# EAGLE schematic ArdBir final (EAGLE 7.1.0)
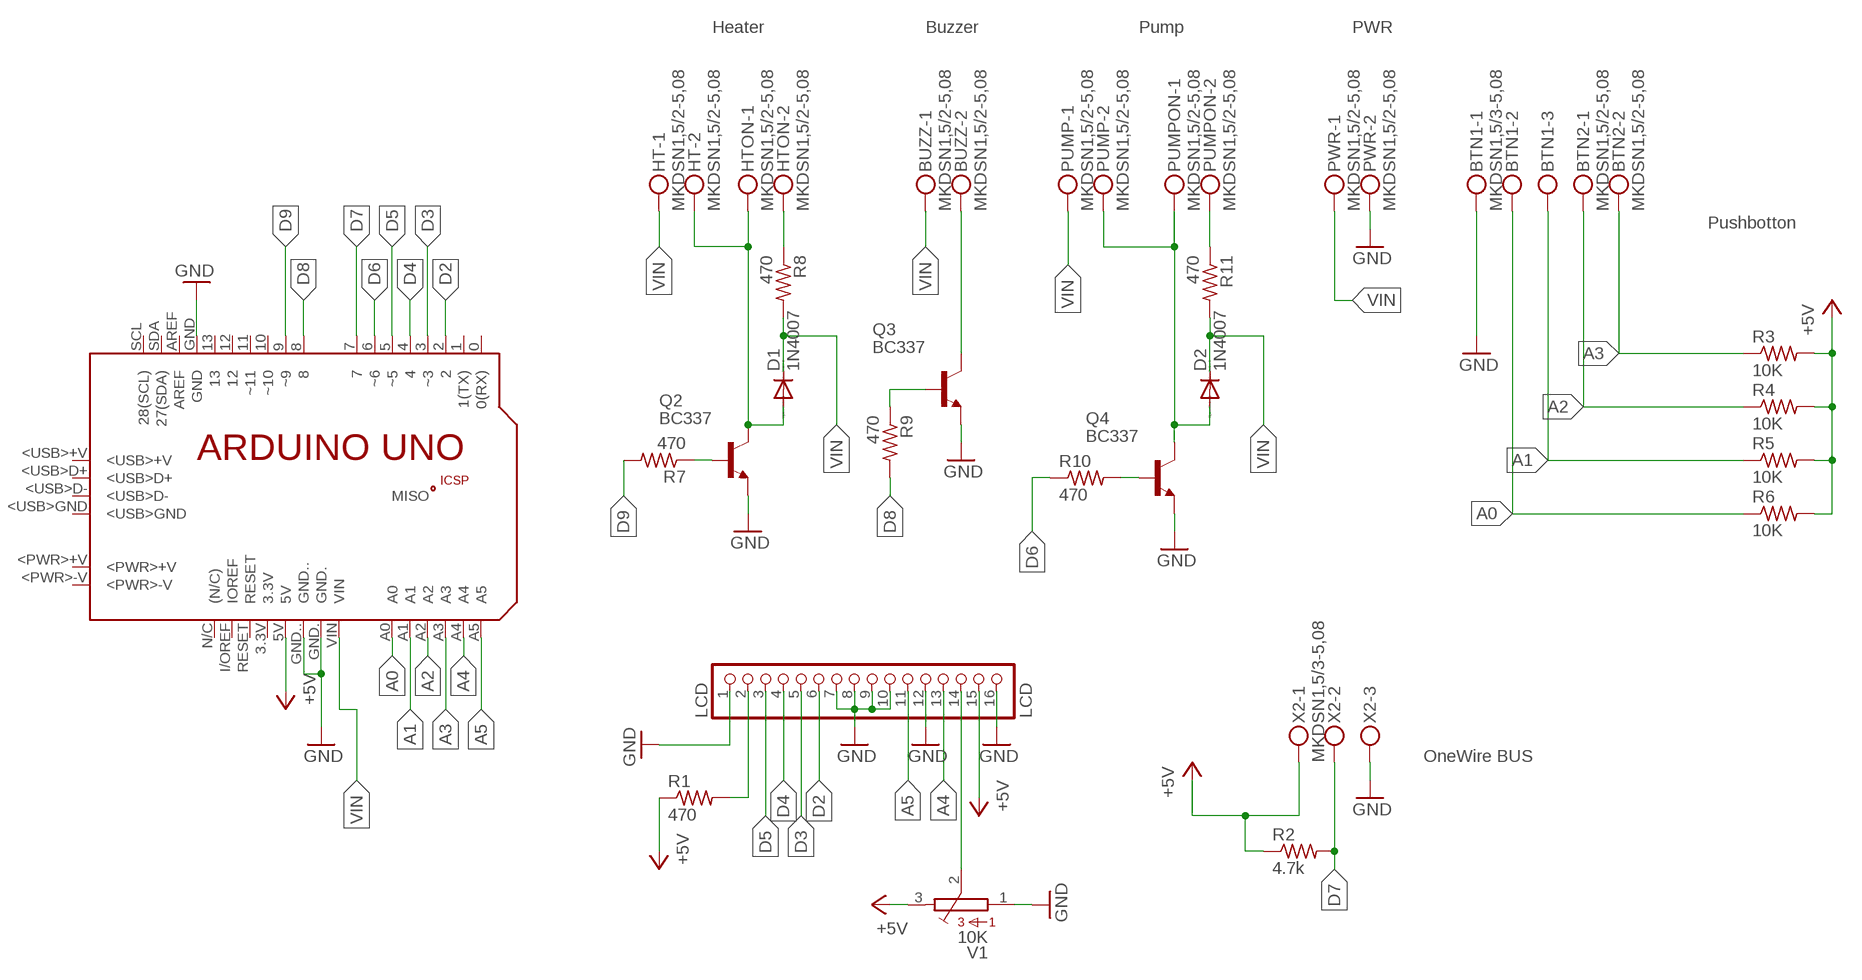
[diagram p0: schematic, sheet 1]

## Parts
BTN1  MKDSN1,5/3-5,08  [MKDSN1,5/3-5,08]
BTN2  MKDSN1,5/2-5,08  [MKDSN1,5/2-5,08]
BUZZ  MKDSN1,5/2-5,08  [MKDSN1,5/2-5,08]
D1  1N4007  1N4004  [DO41-10]
D2  1N4007  1N4004  [DO41-10]
HT  MKDSN1,5/2-5,08  [MKDSN1,5/2-5,08]
HTON  MKDSN1,5/2-5,08  [MKDSN1,5/2-5,08]
LCD  LCD  PINHD-1X16  [1X16]
PCB1  ARDUINO_UNO  [ARDUINO_UNO]
PUMP  MKDSN1,5/2-5,08  [MKDSN1,5/2-5,08]
PUMPON  MKDSN1,5/2-5,08  [MKDSN1,5/2-5,08]
PWR  MKDSN1,5/2-5,08  [MKDSN1,5/2-5,08]
Q2  BC337  [TO92]
Q3  BC337  [TO92]
Q4  BC337  [TO92]
R1  470  R-US_0207/10  [0207/10]
R2  4.7k  R-US_0207/10  [0207/10]
R3  10K  R-US_0207/10  [0207/10]
R4  10K  R-US_0207/10  [0207/10]
R5  10K  R-US_0207/10  [0207/10]
R6  10K  R-US_0207/10  [0207/10]
R7  470  R-US_0207/10  [0207/10]
R8  470  R-US_0207/10  [0207/10]
R9  470  R-US_0207/10  [0207/10]
R10  470  R-US_0207/10  [0207/10]
R11  470  R-US_0207/10  [0207/10]
V1  10K  CA9V  [CA9V]
X2  MKDSN1,5/3-5,08  [MKDSN1,5/3-5,08]

## Nets
+5V [PWR]: LCD.15 PCB1.5V R1.1 R2.1 R3.2 R4.2 R5.2 R6.2 V1.3 X2.1
A0: BTN1.2 PCB1.A0 R6.1
A1: BTN1.3 PCB1.A1 R5.1
A2: BTN2.1 PCB1.A2 R4.1
A3: BTN2.2 PCB1.A3 R3.1
A4: LCD.13 PCB1.A4
A5: LCD.11 PCB1.A5
D2: LCD.6 PCB1.2
D3: LCD.5 PCB1.3(~3)
D4: LCD.4 PCB1.4
D5: LCD.3 PCB1.5(~5)
D6: PCB1.6(~6) R10.1
D7: PCB1.7 R2.2 X2.2
D8: PCB1.8 R9.2
D9: PCB1.9(~9) R7.2
GND: BTN1.1 LCD.1 LCD.7 LCD.8 LCD.9 LCD.10 LCD.12 LCD.16 PCB1.GND PCB1.GND. PCB1.GND.. PWR.2 Q2.1(E) Q3.1(E) Q4.1(E) V1.1 X2.3
N$1: PUMPON.2 R11.1
N$2: D1.A HT.2 HTON.1 Q2.3(C)
N$3: Q2.2(B) R7.1
N$4: LCD.14 V1.2
N$5: HTON.2 R8.1
N$6: BUZZ.2 Q3.3(C)
N$7: Q3.2(B) R9.1
N$8: LCD.2 R1.2
N$9: Q4.2(B) R10.2
N$11: D2.A PUMP.2 PUMPON.1 Q4.3(C)
VIN [PWR]: BUZZ.1 D1.C D2.C HT.1 PCB1.VIN PUMP.1 PWR.1 R8.2 R11.2
Unconnected: PCB1.0(0(RX)) PCB1.1(1(TX)) PCB1.01(MISO) PCB1.3.3V PCB1.10(~10) PCB1.11(~11) PCB1.12 PCB1.13 PCB1.+5V PCB1.<PWR>+V PCB1.<PWR>-V PCB1.<USB>+V PCB1.<USB>D+ PCB1.<USB>D- PCB1.<USB>GND PCB1.AREF PCB1.GND_ PCB1.I/OREF(IOREF) PCB1.MOSI PCB1.N/C((N/C)) PCB1.RESET PCB1.RESET. PCB1.SCK PCB1.SCL(28(SCL)) PCB1.SDA(27(SDA))

## Notes on the sheet
- Heater | Buzzer | Pump | PWR
- Pushbotton
- OneWire BUS

## Library data of the parts
BTN1 X2 = con-phoenix-508:MKDSN1,5/3-5,08: MKDSN 1,5/ 3-5,08 Printklemme Nennstrom: 13,5 A Nennspannung: 250 V Rastermaß: 5,08 mm Polzahl: 3 Anschlussart: Schraubanschluss Montage: Löten Anschlussrichtung Leiter/Platine: 0 ° Artikelnummer: 1729131 Source: http://eshop.phoenixcontact.com .. 1729131.pdf; OC_NEWARK: unknown
BTN2 BUZZ HT HTON PUMP PUMPON PWR = con-phoenix-508:MKDSN1,5/2-5,08: MKDSN 1,5/ 2-5,08 Printklemme Nennstrom: 13,5 A Nennspannung: 250 V Rastermaß: 5,08 mm Polzahl: 2 Anschlussart: Schraubanschluss Montage: Löten Anschlussrichtung Leiter/Platine: 0 ° Artikelnummer: 1729128 Source: http://eshop.phoenixcontact.com .. 1729128.pdf; OC_NEWARK: unknown
D1 D2 = diode:1N4004: DIODE general purpose rectifier, 1 A; OC_NEWARK: unknown
LCD = pinhead:PINHD-1X16: PIN HEADER; OC_NEWARK: unknown
PCB1 = E14_Arduino_published:ARDUINO_UNO: Device for representing an Arduino Uno board with a footprint in an EAGLE design. Created by Dave Young for Element14. More EAGLE documentation at: http://www.element14.com/community/community/knode/cadsoft_eagle
Q2-Q4 = transistor-npn:BC337*: NPN Transistor; OC_NEWARK: unknown
R1-R11 = resistor:R-US_: RESISTOR, American symbol; OC_NEWARK: unknown
V1 = pot:CA9V: POTENTIOMETER; OC_NEWARK: unknown

## Net classes
0 default: width 0.813 mm, clearance 0.205 mm
1 PWR: width 1.27 mm, clearance 0.205 mm to class 0, clearance 0.205 mm